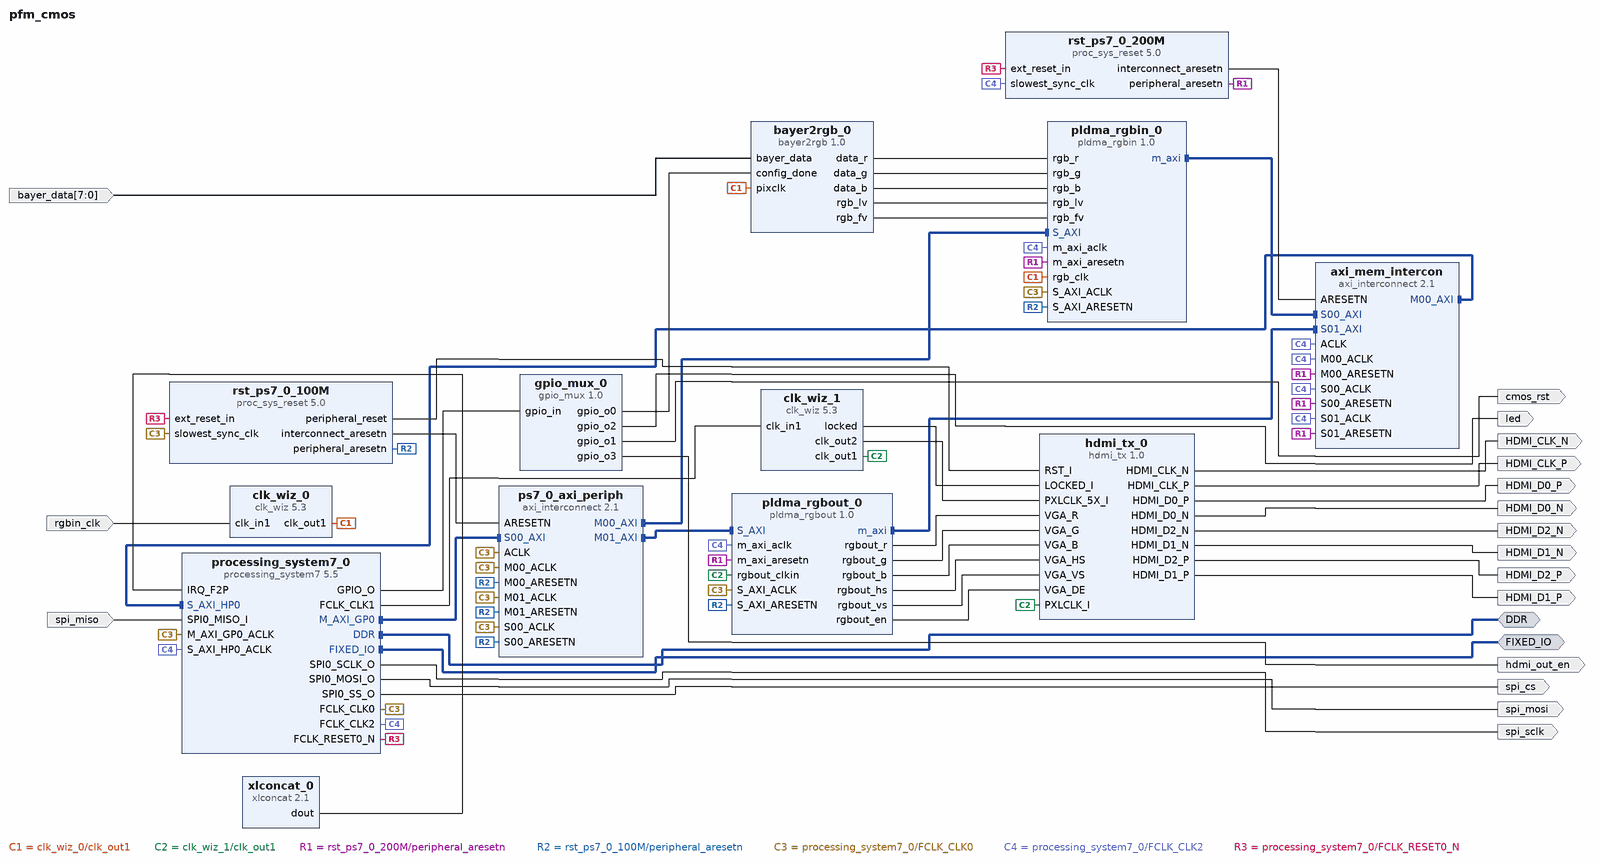
[diagram p0: block diagram of the top level]
# Vivado block design pfm_cmos, xc7z020clg400-1, Vivado 2016.4_sdx
create_bd_design pfm_cmos

create_bd_intf_port -mode Master -vlnv xilinx.com:interface:ddrx_rtl:1.0 DDR
create_bd_intf_port -mode Master -vlnv xilinx.com:display_processing_system7:fixedio_rtl:1.0 FIXED_IO
create_bd_port -dir O spi_sclk
create_bd_port -dir O spi_mosi
create_bd_port -dir I spi_miso
create_bd_port -dir O spi_cs
create_bd_port -dir O cmos_rst
create_bd_port -dir I -type clk rgbin_clk
set_property -dict {CONFIG.FREQ_HZ 74250000} [get_bd_ports rgbin_clk]
create_bd_port -dir I -from 7 -to 0 bayer_data
create_bd_port -dir O HDMI_CLK_N
create_bd_port -dir O HDMI_CLK_P
create_bd_port -dir O HDMI_D2_N
create_bd_port -dir O HDMI_D2_P
create_bd_port -dir O HDMI_D0_P
create_bd_port -dir O HDMI_D1_N
create_bd_port -dir O HDMI_D1_P
create_bd_port -dir O HDMI_D0_N
create_bd_port -dir O led
create_bd_port -dir O hdmi_out_en

create_bd_cell -type ip -vlnv xilinx.com:user:gpio_mux:1.0 gpio_mux_0
create_bd_cell -type ip -vlnv xilinx.com:user:bayer2rgb:1.0 bayer2rgb_0
create_bd_cell -type ip -vlnv xilinx.com:ip:clk_wiz:5.3 clk_wiz_0
set_property -dict [list \
  CONFIG.PRIM_IN_FREQ 74.25 \
  CONFIG.CLKIN1_JITTER_PS 134.68 \
  CONFIG.CLKOUT1_REQUESTED_OUT_FREQ 74.25 \
  CONFIG.CLKOUT1_REQUESTED_PHASE 45 \
  CONFIG.USE_LOCKED false \
  CONFIG.USE_RESET false \
  CONFIG.MMCM_DIVCLK_DIVIDE 1 \
  CONFIG.MMCM_CLKFBOUT_MULT_F 13.000 \
  CONFIG.MMCM_CLKIN1_PERIOD 13.468 \
  CONFIG.MMCM_CLKOUT0_DIVIDE_F 13.000 \
  CONFIG.MMCM_CLKOUT0_PHASE 45.000 \
  CONFIG.CLKOUT1_JITTER 154.367 \
  CONFIG.CLKOUT1_PHASE_ERROR 105.183 \
] [get_bd_cells clk_wiz_0]
create_bd_cell -type ip -vlnv xilinx.com:user:pldma_rgbin:1.0 pldma_rgbin_0
create_bd_cell -type ip -vlnv xilinx.com:ip:clk_wiz:5.3 clk_wiz_1
set_property -dict [list \
  CONFIG.PRIM_IN_FREQ 100.000 \
  CONFIG.CLKOUT2_USED true \
  CONFIG.NUM_OUT_CLKS 2 \
  CONFIG.CLKOUT1_REQUESTED_OUT_FREQ 148.5 \
  CONFIG.CLKOUT2_REQUESTED_OUT_FREQ 742.5 \
  CONFIG.USE_LOCKED true \
  CONFIG.USE_RESET false \
  CONFIG.MMCM_DIVCLK_DIVIDE 5 \
  CONFIG.MMCM_CLKFBOUT_MULT_F 37.125 \
  CONFIG.MMCM_CLKOUT0_DIVIDE_F 5.000 \
  CONFIG.MMCM_CLKOUT1_DIVIDE 1 \
  CONFIG.CLKOUT1_JITTER 298.245 \
  CONFIG.CLKOUT1_PHASE_ERROR 322.999 \
  CONFIG.CLKOUT2_JITTER 232.529 \
  CONFIG.CLKOUT2_PHASE_ERROR 322.999 \
] [get_bd_cells clk_wiz_1]
create_bd_cell -type ip -vlnv xilinx.com:user:pldma_rgbout:1.0 pldma_rgbout_0
set_property -dict [list \
  CONFIG.C_M_AXI_DATA_WIDTH 64 \
  CONFIG.C_MAX_BURST_LEN 256 \
  CONFIG.EnableDebug false \
] [get_bd_cells pldma_rgbout_0]
create_bd_cell -type ip -vlnv xilinx.com:ip:axi_interconnect:2.1 axi_mem_intercon
set_property -dict {CONFIG.NUM_SI 2 CONFIG.NUM_MI 1} [get_bd_cells axi_mem_intercon]
create_bd_cell -type ip -vlnv xilinx.com:ip:proc_sys_reset:5.0 rst_ps7_0_200M
create_bd_cell -type ip -vlnv xilinx.com:ip:axi_interconnect:2.1 ps7_0_axi_periph
set_property -dict {CONFIG.NUM_MI 2} [get_bd_cells ps7_0_axi_periph]
create_bd_cell -type ip -vlnv xilinx.com:ip:proc_sys_reset:5.0 rst_ps7_0_100M
create_bd_cell -type ip -vlnv xilinx.com:user:hdmi_tx:1.0 hdmi_tx_0
create_bd_cell -type ip -vlnv xilinx.com:ip:xlconcat:2.1 xlconcat_0
set_property -dict {CONFIG.NUM_PORTS 1} [get_bd_cells xlconcat_0]
create_bd_cell -type ip -vlnv xilinx.com:ip:processing_system7:5.5 processing_system7_0
set_property -dict [list \
  CONFIG.PCW_FPGA0_PERIPHERAL_FREQMHZ 100 \
  CONFIG.PCW_FPGA1_PERIPHERAL_FREQMHZ 100 \
  CONFIG.PCW_FPGA2_PERIPHERAL_FREQMHZ 200 \
  CONFIG.PCW_USE_S_AXI_HP0 1 \
  CONFIG.PCW_USE_FABRIC_INTERRUPT 1 \
  CONFIG.PCW_EN_CLK1_PORT 1 \
  CONFIG.PCW_EN_CLK2_PORT 1 \
  CONFIG.PCW_IRQ_F2P_INTR 1 \
  CONFIG.PCW_PRESET_BANK1_VOLTAGE {LVCMOS 1.8V} \
  CONFIG.PCW_UIPARAM_DDR_PARTNO Custom \
  CONFIG.PCW_SD0_PERIPHERAL_ENABLE 1 \
  CONFIG.PCW_UART0_PERIPHERAL_ENABLE 1 \
  CONFIG.PCW_UART0_UART0_IO {MIO 46 .. 47} \
  CONFIG.PCW_SPI0_PERIPHERAL_ENABLE 1 \
  CONFIG.PCW_GPIO_EMIO_GPIO_ENABLE 1 \
  CONFIG.PCW_GPIO_EMIO_GPIO_IO 4 \
] [get_bd_cells processing_system7_0]
# 5 more settings of processing_system7_0 are not shown: defaults, MIO pin electricals, DDR timing, and values the tool derives

# ---- connections ----

connect_bd_intf_net [get_bd_intf_pins pldma_rgbin_0/m_axi] [get_bd_intf_pins axi_mem_intercon/S00_AXI]
connect_bd_intf_net [get_bd_intf_pins ps7_0_axi_periph/M00_AXI] [get_bd_intf_pins pldma_rgbin_0/S_AXI]
connect_bd_intf_net [get_bd_intf_pins ps7_0_axi_periph/M01_AXI] [get_bd_intf_pins pldma_rgbout_0/S_AXI]
connect_bd_intf_net [get_bd_intf_pins pldma_rgbout_0/m_axi] [get_bd_intf_pins axi_mem_intercon/S01_AXI]
connect_bd_intf_net [get_bd_intf_pins processing_system7_0/M_AXI_GP0] [get_bd_intf_pins ps7_0_axi_periph/S00_AXI]
connect_bd_intf_net [get_bd_intf_pins processing_system7_0/S_AXI_HP0] [get_bd_intf_pins axi_mem_intercon/M00_AXI]
connect_bd_intf_net [get_bd_intf_ports DDR] [get_bd_intf_pins processing_system7_0/DDR]
connect_bd_intf_net [get_bd_intf_ports FIXED_IO] [get_bd_intf_pins processing_system7_0/FIXED_IO]
connect_bd_net -net clk_in1_1 [get_bd_ports rgbin_clk] [get_bd_pins clk_wiz_0/clk_in1]
connect_bd_net [get_bd_pins clk_wiz_0/clk_out1] [get_bd_pins bayer2rgb_0/pixclk] [get_bd_pins pldma_rgbin_0/rgb_clk]
connect_bd_net [get_bd_ports bayer_data] [get_bd_pins bayer2rgb_0/bayer_data]
connect_bd_net [get_bd_pins bayer2rgb_0/data_r] [get_bd_pins pldma_rgbin_0/rgb_r]
connect_bd_net [get_bd_pins bayer2rgb_0/data_g] [get_bd_pins pldma_rgbin_0/rgb_g]
connect_bd_net [get_bd_pins bayer2rgb_0/data_b] [get_bd_pins pldma_rgbin_0/rgb_b]
connect_bd_net [get_bd_pins bayer2rgb_0/rgb_lv] [get_bd_pins pldma_rgbin_0/rgb_lv]
connect_bd_net [get_bd_pins bayer2rgb_0/rgb_fv] [get_bd_pins pldma_rgbin_0/rgb_fv]
connect_bd_net [get_bd_pins clk_wiz_1/clk_out1] [get_bd_pins pldma_rgbout_0/rgbout_clkin] [get_bd_pins hdmi_tx_0/PXLCLK_I]
connect_bd_net [get_bd_pins rst_ps7_0_200M/peripheral_aresetn] \
  [get_bd_pins pldma_rgbin_0/m_axi_aresetn] [get_bd_pins pldma_rgbout_0/m_axi_aresetn] \
  [get_bd_pins axi_mem_intercon/S00_ARESETN] [get_bd_pins axi_mem_intercon/M00_ARESETN] \
  [get_bd_pins axi_mem_intercon/S01_ARESETN]
connect_bd_net [get_bd_pins rst_ps7_0_200M/interconnect_aresetn] [get_bd_pins axi_mem_intercon/ARESETN]
connect_bd_net [get_bd_pins rst_ps7_0_100M/peripheral_aresetn] \
  [get_bd_pins pldma_rgbin_0/S_AXI_ARESETN] [get_bd_pins pldma_rgbout_0/S_AXI_ARESETN] \
  [get_bd_pins ps7_0_axi_periph/S00_ARESETN] [get_bd_pins ps7_0_axi_periph/M00_ARESETN] \
  [get_bd_pins ps7_0_axi_periph/M01_ARESETN]
connect_bd_net [get_bd_pins rst_ps7_0_100M/interconnect_aresetn] [get_bd_pins ps7_0_axi_periph/ARESETN]
connect_bd_net [get_bd_pins clk_wiz_1/locked] [get_bd_pins hdmi_tx_0/LOCKED_I]
connect_bd_net [get_bd_pins clk_wiz_1/clk_out2] [get_bd_pins hdmi_tx_0/PXLCLK_5X_I]
connect_bd_net [get_bd_pins pldma_rgbout_0/rgbout_r] [get_bd_pins hdmi_tx_0/VGA_R]
connect_bd_net [get_bd_pins pldma_rgbout_0/rgbout_g] [get_bd_pins hdmi_tx_0/VGA_G]
connect_bd_net [get_bd_pins pldma_rgbout_0/rgbout_b] [get_bd_pins hdmi_tx_0/VGA_B]
connect_bd_net [get_bd_pins pldma_rgbout_0/rgbout_hs] [get_bd_pins hdmi_tx_0/VGA_HS]
connect_bd_net [get_bd_pins pldma_rgbout_0/rgbout_vs] [get_bd_pins hdmi_tx_0/VGA_VS]
connect_bd_net [get_bd_pins pldma_rgbout_0/rgbout_en] [get_bd_pins hdmi_tx_0/VGA_DE]
connect_bd_net [get_bd_pins rst_ps7_0_100M/peripheral_reset] [get_bd_pins hdmi_tx_0/RST_I]
connect_bd_net [get_bd_pins hdmi_tx_0/HDMI_CLK_N] [get_bd_ports HDMI_CLK_N]
connect_bd_net [get_bd_pins hdmi_tx_0/HDMI_CLK_P] [get_bd_ports HDMI_CLK_P]
connect_bd_net [get_bd_pins hdmi_tx_0/HDMI_D2_N] [get_bd_ports HDMI_D2_N]
connect_bd_net [get_bd_pins hdmi_tx_0/HDMI_D2_P] [get_bd_ports HDMI_D2_P]
connect_bd_net [get_bd_pins hdmi_tx_0/HDMI_D0_P] [get_bd_ports HDMI_D0_P]
connect_bd_net [get_bd_pins hdmi_tx_0/HDMI_D1_N] [get_bd_ports HDMI_D1_N]
connect_bd_net [get_bd_pins hdmi_tx_0/HDMI_D1_P] [get_bd_ports HDMI_D1_P]
connect_bd_net [get_bd_pins hdmi_tx_0/HDMI_D0_N] [get_bd_ports HDMI_D0_N]
connect_bd_net [get_bd_pins gpio_mux_0/gpio_o2] [get_bd_ports led]
connect_bd_net [get_bd_pins gpio_mux_0/gpio_o3] [get_bd_ports hdmi_out_en]
connect_bd_net [get_bd_ports spi_miso] [get_bd_pins processing_system7_0/SPI0_MISO_I]
connect_bd_net [get_bd_pins processing_system7_0/SPI0_SCLK_O] [get_bd_ports spi_sclk]
connect_bd_net [get_bd_pins processing_system7_0/SPI0_MOSI_O] [get_bd_ports spi_mosi]
connect_bd_net [get_bd_pins processing_system7_0/SPI0_SS_O] [get_bd_ports spi_cs]
connect_bd_net [get_bd_pins processing_system7_0/FCLK_CLK0] \
  [get_bd_pins processing_system7_0/M_AXI_GP0_ACLK] [get_bd_pins pldma_rgbin_0/S_AXI_ACLK] \
  [get_bd_pins pldma_rgbout_0/S_AXI_ACLK] [get_bd_pins rst_ps7_0_100M/slowest_sync_clk] \
  [get_bd_pins ps7_0_axi_periph/S00_ACLK] [get_bd_pins ps7_0_axi_periph/ACLK] [get_bd_pins ps7_0_axi_periph/M00_ACLK] \
  [get_bd_pins ps7_0_axi_periph/M01_ACLK]
connect_bd_net [get_bd_pins processing_system7_0/FCLK_CLK2] \
  [get_bd_pins processing_system7_0/S_AXI_HP0_ACLK] [get_bd_pins pldma_rgbin_0/m_axi_aclk] \
  [get_bd_pins pldma_rgbout_0/m_axi_aclk] [get_bd_pins rst_ps7_0_200M/slowest_sync_clk] \
  [get_bd_pins axi_mem_intercon/S00_ACLK] [get_bd_pins axi_mem_intercon/ACLK] [get_bd_pins axi_mem_intercon/M00_ACLK] \
  [get_bd_pins axi_mem_intercon/S01_ACLK]
connect_bd_net [get_bd_pins xlconcat_0/dout] [get_bd_pins processing_system7_0/IRQ_F2P]
connect_bd_net [get_bd_pins processing_system7_0/FCLK_CLK1] [get_bd_pins clk_wiz_1/clk_in1]
connect_bd_net [get_bd_pins processing_system7_0/FCLK_RESET0_N] [get_bd_pins rst_ps7_0_200M/ext_reset_in] [get_bd_pins rst_ps7_0_100M/ext_reset_in]
connect_bd_net [get_bd_pins processing_system7_0/GPIO_O] [get_bd_pins gpio_mux_0/gpio_in]
connect_bd_net [get_bd_pins gpio_mux_0/gpio_o0] [get_bd_pins bayer2rgb_0/config_done]
connect_bd_net [get_bd_pins gpio_mux_0/gpio_o1] [get_bd_ports cmos_rst]

# ---- address map ----
assign_bd_address -offset 0x00000000 -range 512M -target_address_space [get_bd_addr_spaces pldma_rgbin_0/m_axi] [get_bd_addr_segs processing_system7_0/S_AXI_HP0/HP0_DDR_LOWOCM]
assign_bd_address -offset 0x00000000 -range 512M -target_address_space [get_bd_addr_spaces pldma_rgbout_0/m_axi] [get_bd_addr_segs processing_system7_0/S_AXI_HP0/HP0_DDR_LOWOCM]
assign_bd_address -offset 0x40010000 -range 64K -target_address_space [get_bd_addr_spaces processing_system7_0/Data] [get_bd_addr_segs pldma_rgbin_0/S_AXI/reg0]
assign_bd_address -offset 0x40020000 -range 64K -target_address_space [get_bd_addr_spaces processing_system7_0/Data] [get_bd_addr_segs pldma_rgbout_0/S_AXI/reg0]

validate_bd_design
save_bd_design
